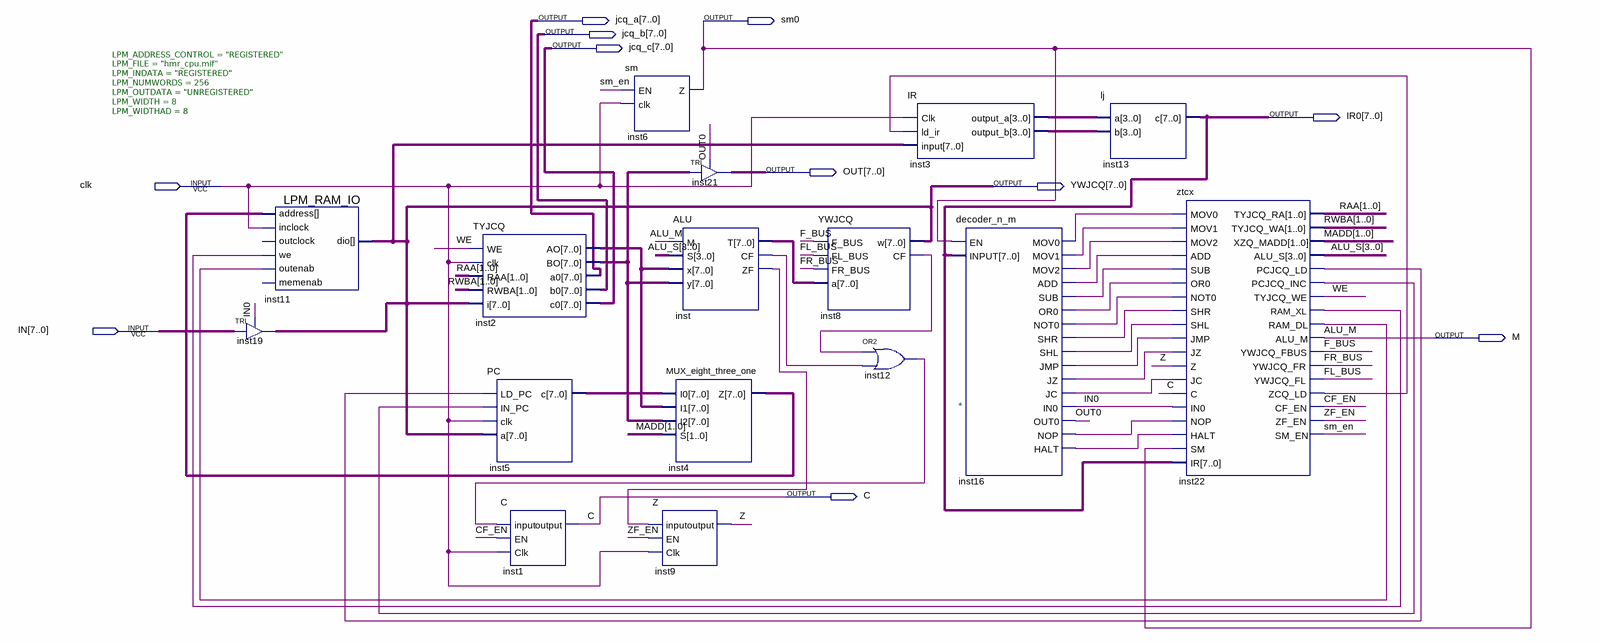
[diagram p0: schematic sheet]
// Quartus schematic hmr_cpu.bdf as structural Verilog: 16 symbols, 11 pins
module hmr_cpu (
  input  clk,
  input  [7:0] IN,
  output [7:0] jcq_a,
  output sm0,
  output [7:0] jcq_b,
  output [7:0] jcq_c,
  output [7:0] IR0,
  output [7:0] OUT,
  output [7:0] YWJCQ,
  output M,
  output C
);

  wire CF_EN, F_BUS, FL_BUS, FR_BUS, inst8_cf, inst12_out, inst16_add, inst16_halt, inst16_jc, inst16_jmp,
       inst16_jz, inst16_mov0, inst16_mov1, inst16_mov2, inst16_nop, inst16_not0, inst16_or0, inst16_shl,
       inst16_shr, inst16_sub, inst22_pcjcq_inc, inst22_pcjcq_ld, inst22_ram_dl, inst22_ram_xl,
       inst22_zcq_ld, inst_cf, inst_zf, sm_en, WE, Z, ZF_EN;
  wire [1:0] MADD, RAA, RWBA;
  wire [3:0] ALU_S, inst3_output_a, inst3_output_b;
  wire [7:0] inst2_ao, inst2_bo, inst4_z, inst5_c, inst_t;

  TRI inst19[7:0] (.IN(IN), .OE(IN[0]), .OUT(YWJCQ));
  LPM_RAM_IO #(.LPM_ADDRESS_CONTROL("REGISTERED"), .LPM_FILE("hmr_cpu.mif"), .LPM_INDATA("REGISTERED"), .LPM_NUMWORDS(256), .LPM_OUTDATA("UNREGISTERED"), .LPM_WIDTH(8), .LPM_WIDTHAD(8)) inst11 (
    .address(inst4_z), .inclock(clk), .we(inst22_ram_xl), .outenab(inst22_ram_dl), .dio(YWJCQ));  // open: outclock, memenab
  TYJCQ inst2 (
    .WE(WE), .clk(clk), .RAA(RAA), .RWBA(RWBA), .i(YWJCQ), .AO(inst2_ao), .BO(inst2_bo), .a0(jcq_a),
    .b0(jcq_b), .c0(jcq_c));
  PC inst5 (.LD_PC(inst22_pcjcq_ld), .IN_PC(inst22_pcjcq_inc), .clk(clk), .a(YWJCQ), .c(inst5_c));
  C inst1 (.\input (inst12_out), .EN(CF_EN), .Clk(clk), .\output (C));
  sm inst6 (.EN(sm_en), .clk(clk), .Z(sm0));
  TRI inst21[7:0] (.IN(inst2_bo), .OE(OUT[0]), .OUT(OUT));
  ALU inst (.M(M), .S(ALU_S), .x(inst2_ao), .y(inst2_bo), .T(inst_t), .CF(inst_cf), .ZF(inst_zf));
  MUX_eight_three_one inst4 (.I0(inst5_c), .I1(inst2_ao), .I2(inst2_bo), .S(MADD), .Z(inst4_z));
  Z inst9 (.\input (inst_zf), .EN(ZF_EN), .Clk(clk), .\output (Z));
  YWJCQ inst8 (.F_BUS(F_BUS), .FL_BUS(FL_BUS), .FR_BUS(FR_BUS), .a(inst_t), .w(YWJCQ), .CF(inst8_cf));
  IR inst3 (.Clk(clk), .ld_ir(inst22_zcq_ld), .\input (YWJCQ), .output_a(inst3_output_a), .output_b(inst3_output_b));
  or inst12 (inst12_out, inst8_cf, inst_cf);
  decoder_n_m inst16 (
    .EN(sm0), .INPUT(IR0), .MOV0(inst16_mov0), .MOV1(inst16_mov1), .MOV2(inst16_mov2), .ADD(inst16_add),
    .SUB(inst16_sub), .OR0(inst16_or0), .NOT0(inst16_not0), .SHR(inst16_shr), .SHL(inst16_shl),
    .JMP(inst16_jmp), .JZ(inst16_jz), .JC(inst16_jc), .IN0(IN[0]), .OUT0(OUT[0]), .NOP(inst16_nop),
    .HALT(inst16_halt));
  lj inst13 (.a(inst3_output_a), .b(inst3_output_b), .c(IR0));
  ztcx inst22 (
    .MOV0(inst16_mov0), .MOV1(inst16_mov1), .MOV2(inst16_mov2), .ADD(inst16_add), .SUB(inst16_sub),
    .OR0(inst16_or0), .NOT0(inst16_not0), .SHR(inst16_shr), .SHL(inst16_shl), .JMP(inst16_jmp),
    .JZ(inst16_jz), .Z(Z), .JC(inst16_jc), .C(C), .IN0(IN[0]), .NOP(inst16_nop), .HALT(inst16_halt),
    .SM(sm0), .IR(IR0), .TYJCQ_RA(RAA), .TYJCQ_WA(RWBA), .XZQ_MADD(MADD), .ALU_S(ALU_S),
    .PCJCQ_LD(inst22_pcjcq_ld), .PCJCQ_INC(inst22_pcjcq_inc), .TYJCQ_WE(WE), .RAM_XL(inst22_ram_xl),
    .RAM_DL(inst22_ram_dl), .ALU_M(M), .YWJCQ_FBUS(F_BUS), .YWJCQ_FR(FR_BUS), .YWJCQ_FL(FL_BUS),
    .ZCQ_LD(inst22_zcq_ld), .CF_EN(CF_EN), .ZF_EN(ZF_EN), .SM_EN(sm_en));

  // Other names for the same wires on the sheet: ALU_M = M

  // Notes on the sheet:
  //   *
endmodule
